# EAGLE design thermocouple-sensor (EAGLE 5.01)
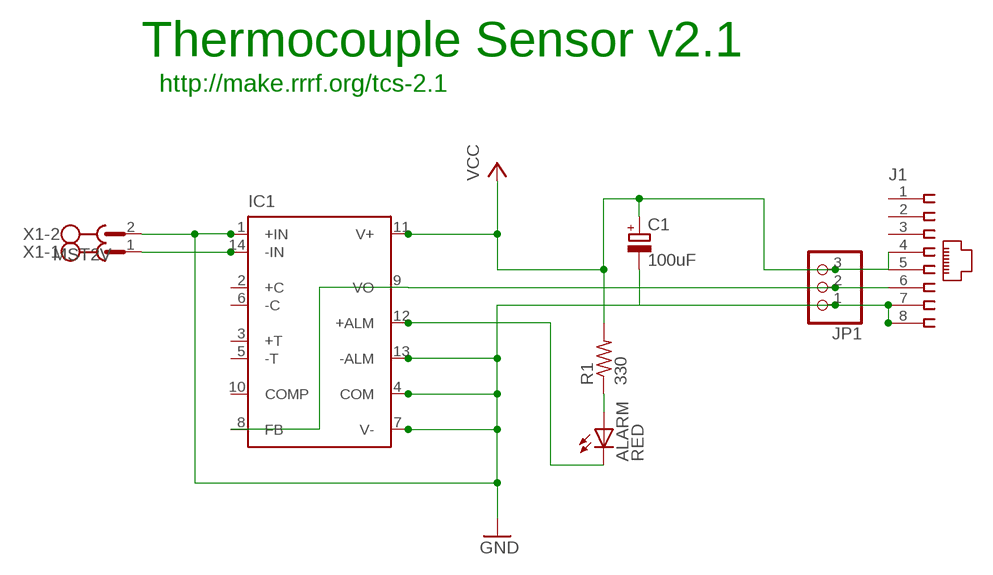
[diagram p0: schematic, sheet 1]

## Parts
ALARM  RED  LED5MM  [LED5MM]
C1  100uF  CPOL-EUE5-10.5  [E5-10,5]
IC1  AD595  [DIL14]
J1  520426-4  [520426-4]
JP1  PINHD-1X3  [1X03]
R1  330  R-US_0207/7  [0207/7]
X1  MST2V  [MSTBV2]

## Nets
GND: C1.- IC1.1(+IN) IC1.4(COM) IC1.7(V-) IC1.13(-ALM) J1.7 J1.8 JP1.1 X1.2
N$1: ALARM.A R1.1
N$2: ALARM.K(C) IC1.12(+ALM)
N$3: IC1.14(-IN) X1.1
N$5: IC1.8(FB) IC1.9(VO) J1.6 JP1.2
VCC: C1.+ IC1.11(V+) J1.4 J1.5 JP1.3 R1.2
Unconnected: IC1.2(+C) IC1.3(+T) IC1.5(-T) IC1.6(-C) IC1.10(COMP) J1.1 J1.2 J1.3

## Notes on the sheet
- Thermocouple Sensor v2.1
- http://make.rrrf.org/tcs-2.1

## Library data of the parts
ALARM = led:LED: LED OSRAM: - CHIPLED LG R971, LG N971, LY N971, LG Q971, LY Q971, LO R971, LY R971 LH N974, LH R974 LS Q976, LO Q976, LY Q976 LO Q996 - Hyper CHIPLED LW Q18S LB Q993, LB Q99A, LB R99A - SideLED LS A670, LO A670, LY A670, LG A670, LP A670 LB A673, LV A673, LT A673, LW A673 LH A674 LY A675 LS A676, LA A676, LO A676, LY A676, LW A676 LS A679, LY A679, LG A679 - Hyper Micro SIDELED® LS Y876, LA Y876, LO Y876, LY Y876 LT Y87S - SmartLED LW L88C, LW L88S LB L89C, LB L89S, LG L890 LS L89K, LO L89K, LY L89K LS L896, LA L896, LO L896, LY L896 - TOPLED LS T670, LO T670, LY T670, LG T670, LP T670 LSG T670, LSP T670, LSY T670, LOP T670, LYG T670 LG T671, LOG T671, LSG T671 LB T673, LV T673, LT T673, LW T673 LH T674 LS T676, LA T676, LO T676, LY T676, LB T676, LH T676, LSB T676, LW T676 LB T67C, LV T67C, LT T67C, LS T67K, LO T67K, LY T67K, LW E67C LS E67B, LA E67B, LO E67B, LY E67B, LB E67C, LV E67C, LT E67C LW T67C LS T679, LY T679, LG T679 LS T770, LO T770, LY T770, LG T770, LP T770 LB T773, LV T773, LT T773, LW T773 LH T774 LS E675, LA E675, LY E675, LS T675 LS T776, LA T776, LO T776, LY T776, LB T776 LHGB T686 LT T68C, LB T68C - Hyper Mini TOPLED® LB M676 - Mini TOPLED Santana® LG M470 LS M47K, LO M47K, LY M47K Source: http://www.osram.convergy.de - LUMILED® LXK2-PW12-R00, LXK2-PW12-S00, LXK2-PW14-U00, LXK2-PW14-V00 LXK2-PM12-R00, LXK2-PM12-S00, LXK2-PM14-U00 LXK2-PE12-Q00, LXK2-PE12-R00, LXK2-PE12-S00, LXK2-PE14-T00, LXK2-PE14-U00 LXK2-PB12-K00, LXK2-PB12-L00, LXK2-PB12-M00, LXK2-PB14-N00, LXK2-PB14-P00, LXK2-PB14-Q00 LXK2-PR12-L00, LXK2-PR12-M00, LXK2-PR14-Q00, LXK2-PR14-R00 LXK2-PD12-Q00, LXK2-PD12-R00, LXK2-PD12-S00 LXK2-PH12-R00, LXK2-PH12-S00 LXK2-PL12-P00, LXK2-PL12-Q00, LXK2-PL12-R00 Source: www.luxeon.com
C1 = rcl:CPOL-EU: POLARIZED CAPACITOR, European symbol
IC1 = analog-devices:AD595: ANALOG DEVICES
J1 = con-amp:520426-4: AMP connector
JP1 = pinhead:PINHD-1X3: PIN HEADER
R1 = rcl:R-US_: RESISTOR, American symbol
X1 = con-phoenix-508:MST2V: PHOENIX

## Board
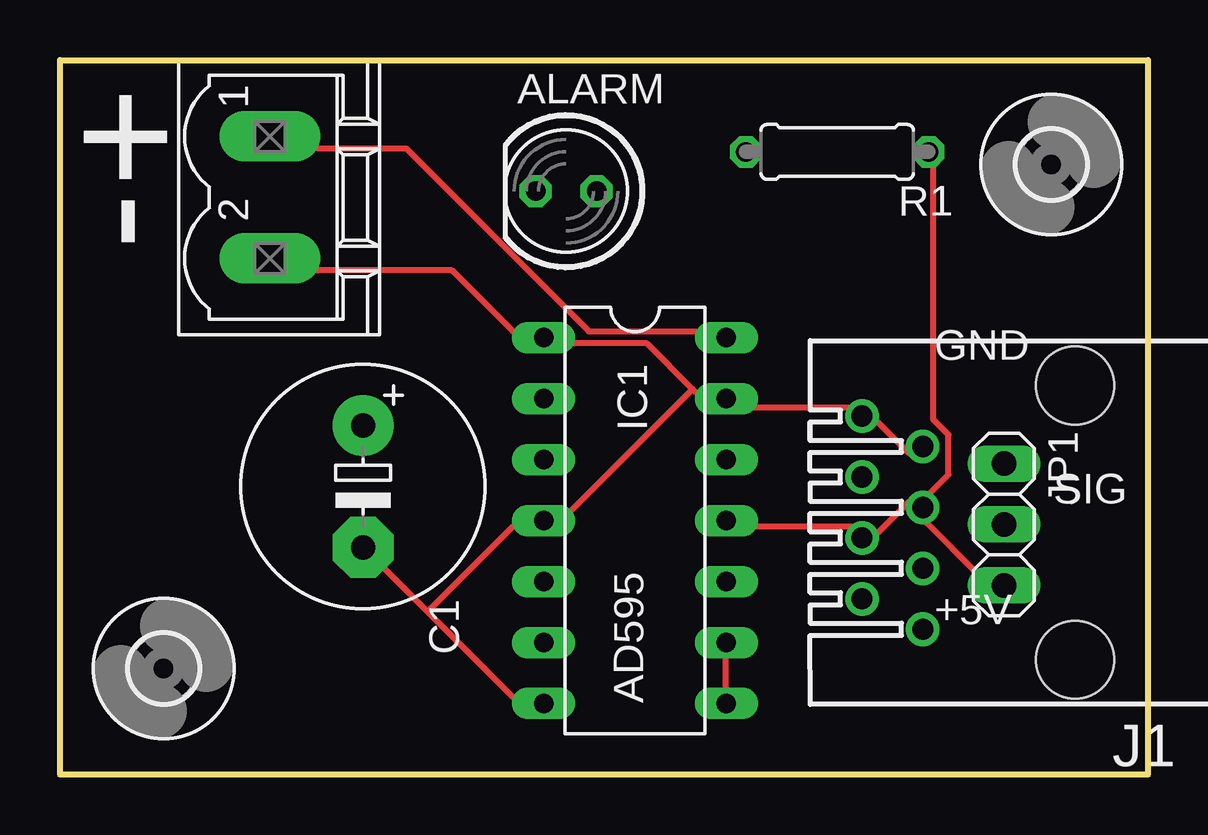
[diagram p1: board, top side]
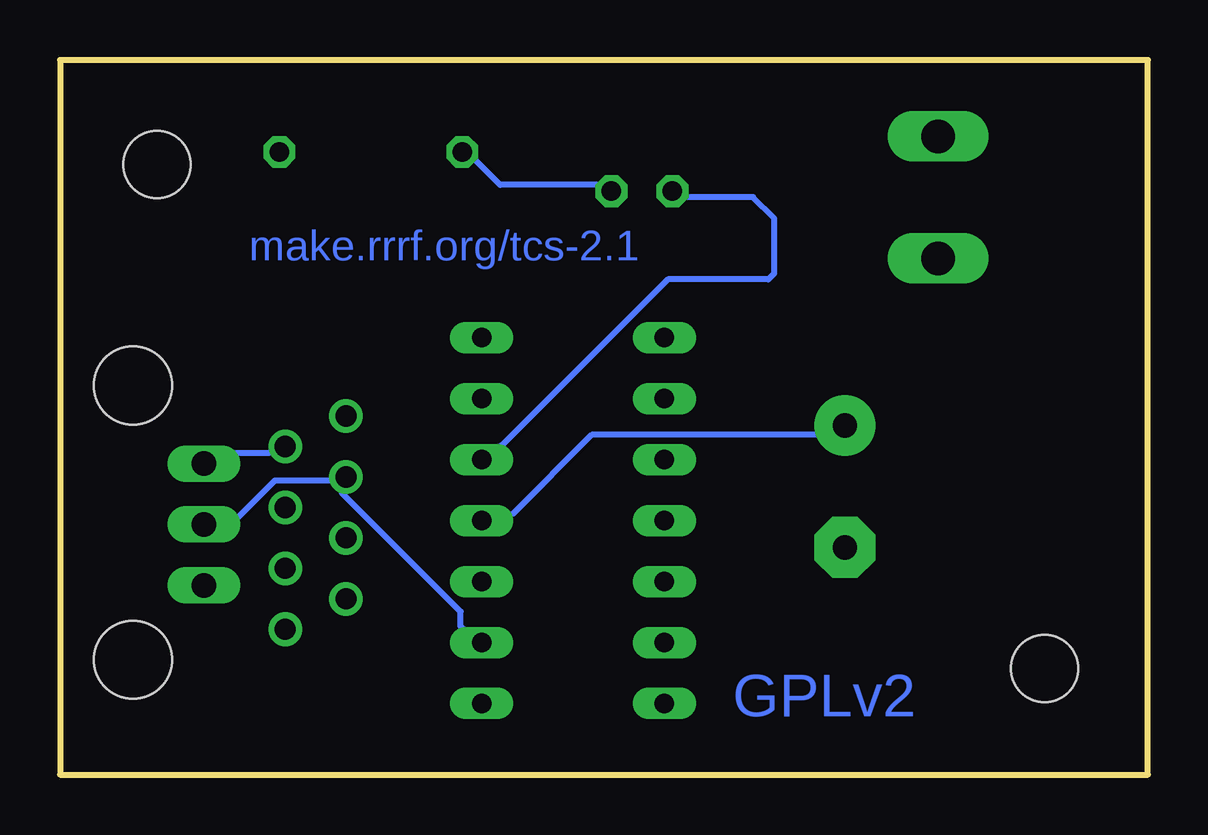
[diagram p2: board, bottom side, seen from below]

Size 45.35 x 29.78 mm. Coordinates in mm from the lower left corner, seen from the top.
Outline: 0,29.78 45.35,29.78 45.35,0 0,0 0,29.78
Copper layers (1*16): Top 0.035mm / dielectric 1.5mm / Bottom 0.035mm
Design rules "default": minimum track width 10mil, minimum drill 24mil, track to track 8mil, track to pad 8mil, pad to pad 8mil, via to via 8mil, smd to smd 8mil, copper to edge 40mil, drill to drill 8mil, minimum pad ring 10mil, minimum via ring 8mil, stop-mask expansion 4mil, vias tented up to drill 0mil, thermal gap 10mil

### Footprints (pad centres in the part's own frame; a part is rotated, then mirrored left to right if it is on the bottom)
LED5MM = drill 0.813 octagon: A -1.27,0; K 1.27,0
E5-10,5 = drill 1.016 pad 2.54 round: + -2.54,0 | drill 1.016 pad 2.54 octagon: - 2.54,0
DIL14 = drill 0.813 long: 1 -7.62,-3.81; 2 -5.08,-3.81; 3 -2.54,-3.81; 4 0,-3.81; 5 2.54,-3.81; 6 5.08,-3.81; 7 7.62,-3.81; 8 7.62,3.81; 9 5.08,3.81; 10 2.54,3.81; 11 0,3.81; 12 -2.54,3.81; 13 -5.08,3.81; 14 -7.62,3.81
520426-4 = drill 0.889 round: 1 -4.445,6.35; 2 -3.175,8.89; 3 -1.905,6.35; 4 -0.635,8.89; 5 0.635,6.35; 6 1.905,8.89; 7 3.175,6.35; 8 4.445,8.89 | hole 3.251: -5.715,0; 5.715,0
1X03 = drill 1.016 long: 1 -2.54,0; 2 0,0; 3 2.54,0
0207/7 = drill 0.813 octagon: 1 -3.81,0; 2 3.81,0
2,8 = hole 2.8: 0,0
MSTBV2 = drill 1.397 long: 1 -2.54,0; 2 2.54,0

### Placement (x,y rotation side)
ALARM  21.1,24.31 180 top
C1  12.63,12.01 270 top
IC1  23.97,10.59 270 top
J1  42.32,10.51 90 top
JP1  39.35,10.43 270 top
R1  32.4,25.95 0 top
U$2  [2,8]  4.32,4.43 0 top
U$3  [2,8]  41.32,25.43 0 top
X1  8.75,24.06 270 top

### Tracks (layer width: path | path; a pad name or v marks a point on that pad's centre or on a via)
GND
  Top 0.254: 15.32,6.79 13.41,8.7 C1.- | 15.32,6.79 18.88,3.24 IC1.7 | 15.32,6.79 18.88,10.35 IC1.4 21.29,10.98 26.37,16.07 | J1.7 35.39,13.4 34.12,14.67 J1.8 32.85,15.3 28.91,15.3 IC1.13 26.5,15.94 26.37,16.07 | 26.37,16.07 24.46,17.97 21.42,17.97 IC1.1 18.88,18.48 16.34,21.02 10.75,21.02 X1.2
  Bottom 0.254: J1.7 36.66,13.4 38.05,13.4 JP1.1
N$1
  Bottom 0.254: ALARM.A 22.94,24.57 27,24.57 28.02,25.59 R1.1
N$2
  Bottom 0.254: IC1.12 26.88,13.78 20.02,20.64 15.83,20.64 15.57,20.89 15.57,23.18 16.46,24.07 19.26,24.07 ALARM.K
N$3
  Top 0.254: IC1.14 26.5,18.48 22.05,18.48 14.43,26.1 10.75,26.1 X1.1
N$5
  Top 0.254: IC1.8 27.77,3.62 27.77,4.89 IC1.9
  Bottom 0.254: JP1.2 37.93,10.73 36.4,12.25 34.12,12.25 J1.6 33.61,11.75 28.66,6.79 28.66,6.16 IC1.9
VCC
  Top 0.254: IC1.11 29.04,10.35 32.97,10.35 J1.4 34.12,10.1 35.39,11.37 J1.5 | R1.2 36.4,25.34 36.4,14.79 37.04,14.16 37.04,12.51 36.27,11.75 J1.5 | JP1.3 38.18,8.45 36.15,10.48 J1.5
  Bottom 0.254: C1.+ 13.8,14.16 23.19,14.16 26.5,10.86 IC1.11

### Text on the board
Bottom: make.rrrf.org/tcs-2.1 | GPLv2
tPlace: - | + | GND | SIG | +5V | AD595